# Altium schematic sheet Sch_Form.SchDoc: Cloud & LoRa Based IoT Hub v1.0
size A3; Engineer: Selcuk Cinar; Organization: SELCUK ELECTRONICS; DocumentNumber: 0; SheetNumber: 1
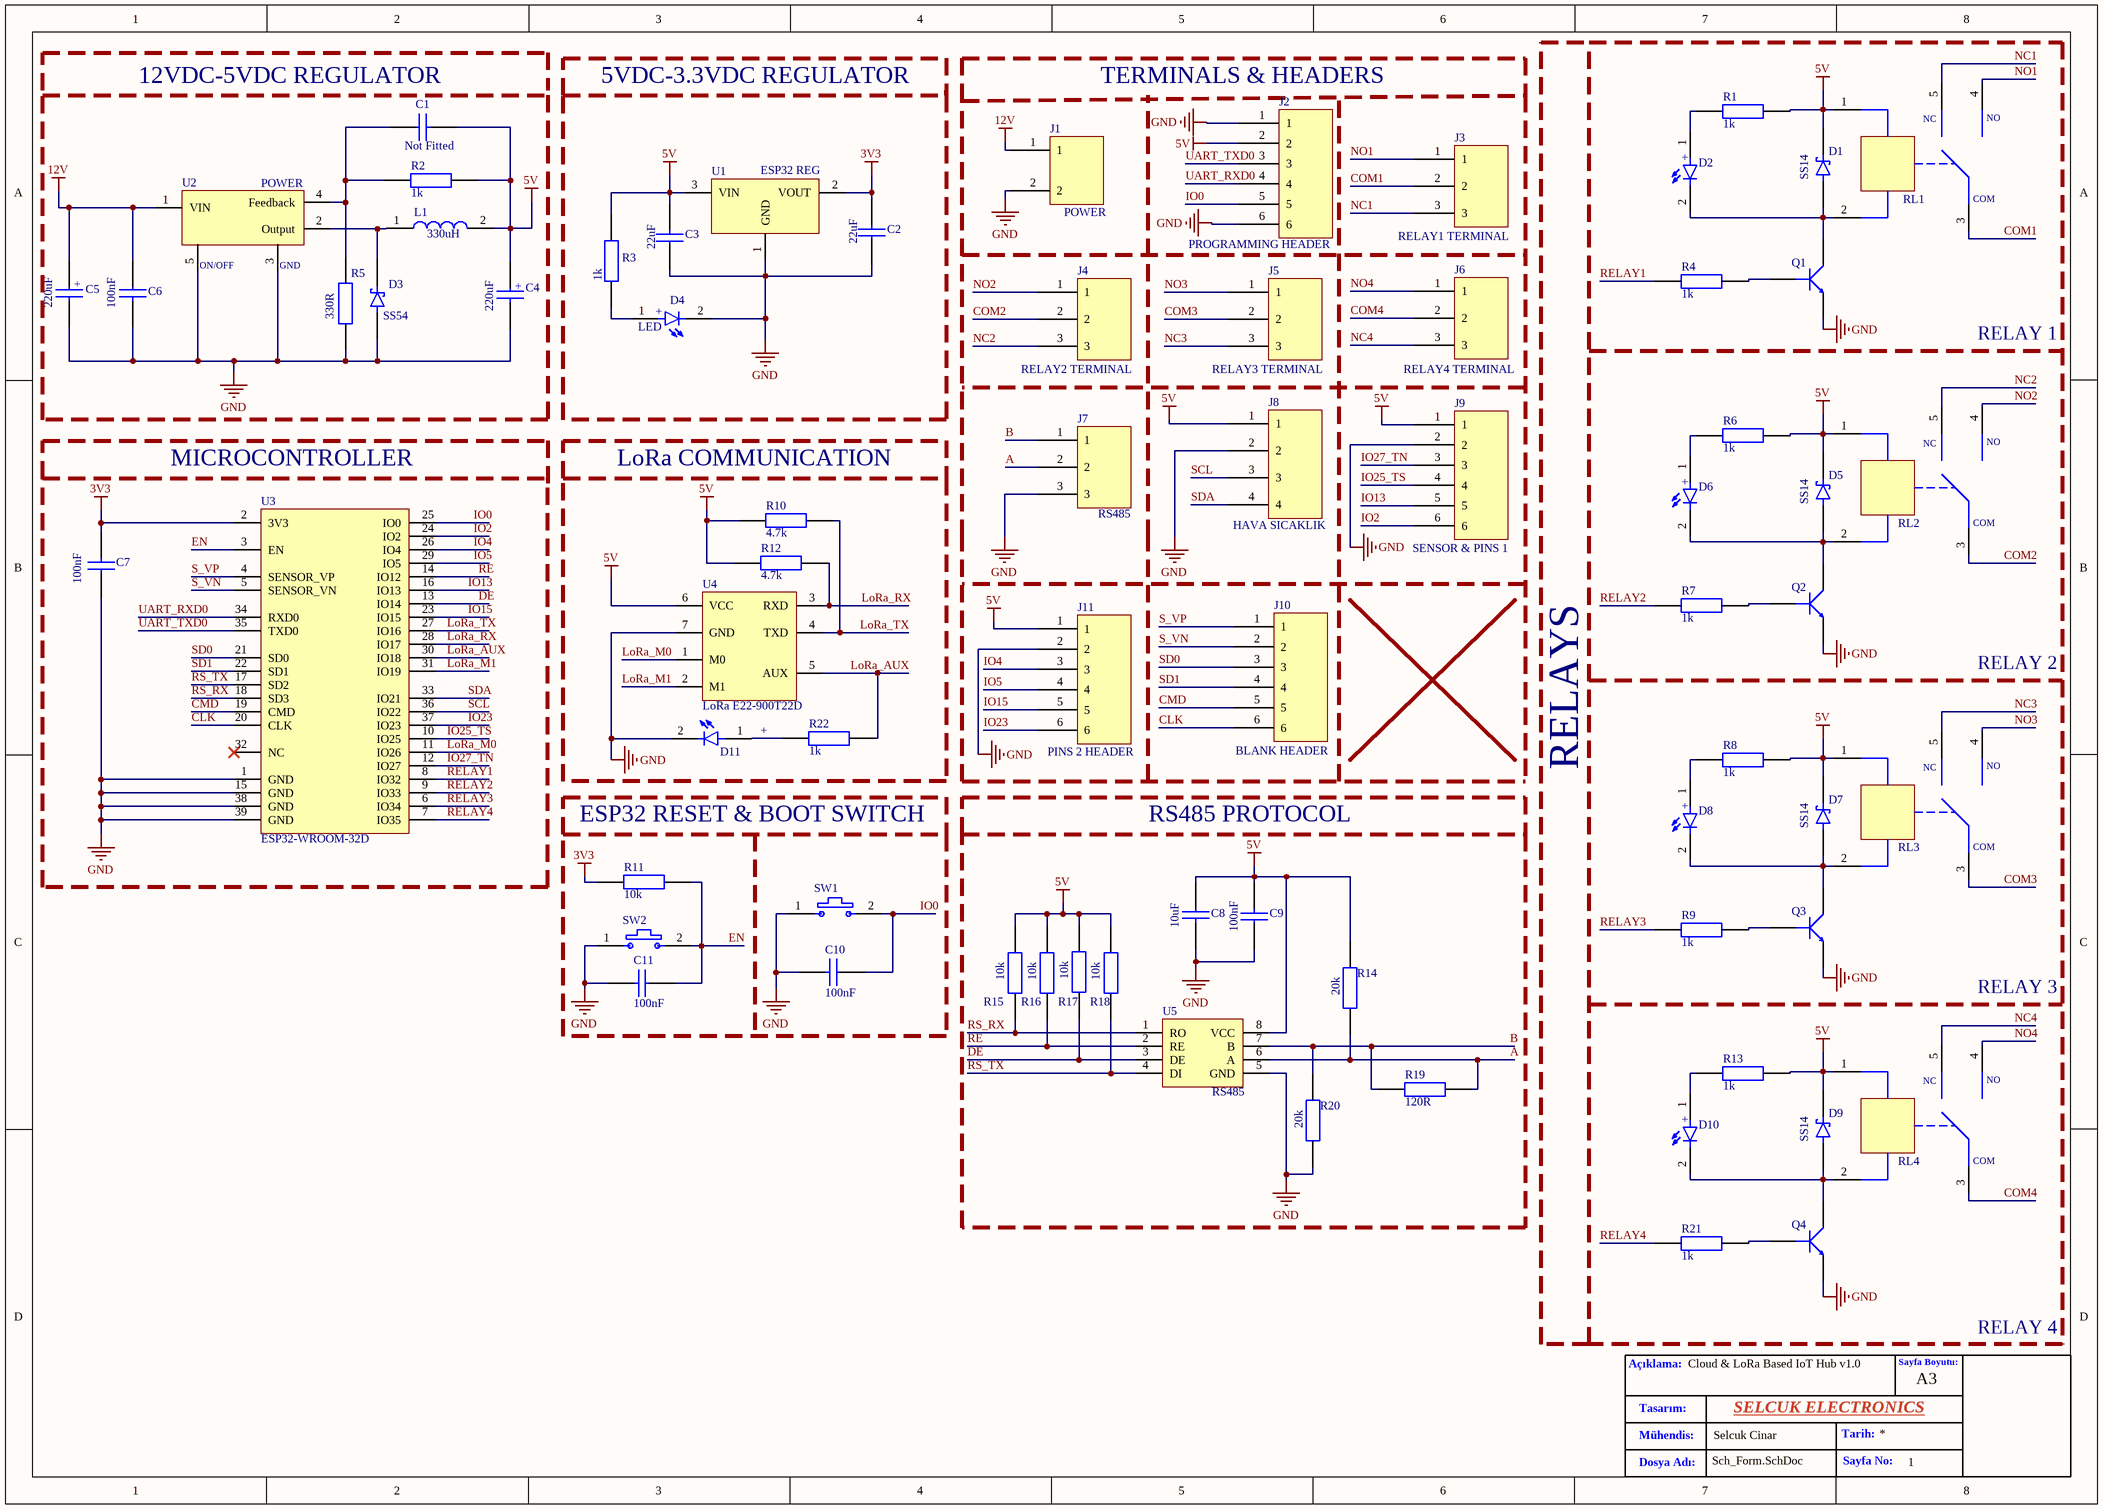
[diagram p0: Sch_Form.SchDoc]

## Parts
C1  Not Fitted  [0805 FITTED CAP]
C2  22uF  [0805 22uF CAP]
C3  22uF  [0805 22uF CAP]
C4  220uF  [220/35V/VT ECAP-0810]
C5  220uF  [100/50V/VT ECAP-0810]
C6  100nF  [0805 100nF CAP]
C7  100nF  [0805 100nF CAP]
C8  10uF  [1206 10uF CAP]
C9  100nF  [0805 100nF CAP]
C10  100nF  [0805 100nF CAP]
C11  100nF  [0805 100nF CAP]
D1  SS14  [SS14-DO-214AC]
D2  LED  [1206 LED]  (value not drawn)
D3  SS54  [SS34]
D4  LED  [1206 LED]
D5  SS14  [SS14-DO-214AC]
D6  LED  [1206 LED]  (value not drawn)
D7  SS14  [SS14-DO-214AC]
D8  LED  [1206 LED]  (value not drawn)
D9  SS14  [SS14-DO-214AC]
D10  LED  [1206 LED]  (value not drawn)
D11  LED  [1206 LED]  (value not drawn)
J1  POWER  [Terminal 2]
J2  PROGRAMMING HEADER  [1x6 HEADER]
J3  RELAY1 TERMINAL  [TERMINAL 3]
J4  RELAY2 TERMINAL  [TERMINAL 3]
J5  RELAY3 TERMINAL  [TERMINAL 3]
J6  RELAY4 TERMINAL  [TERMINAL 3]
J7  RS485  [TERMINAL 3]
J8  HAVA SICAKLIK  [TERMINAL 4]
J9  SENSOR & PINS 1  [TERMINAL 6]
J10  BLANK HEADER  [1x6 HEADER]
J11  PINS 2 HEADER  [1x6 HEADER]
L1  POWER IND  [330uH/470 - INDUCTOR]  (value not drawn)
Q1  RELAY TRANSISTOR  [BC847 NPN]  (value not drawn)
Q2  RELAY TRANSISTOR  [BC847 NPN]  (value not drawn)
Q3  RELAY TRANSISTOR  [BC847 NPN]  (value not drawn)
Q4  RELAY TRANSISTOR  [BC847 NPN]  (value not drawn)
R1  1k  [0805 1K RES]
R2  1k  [0805 1K RES]
R3  1k  [0805 1K RES]
R4  1k  [0805 1K RES]
R5  330R  [0805 330R RES]
R6  1k  [0805 1K RES]
R7  1k  [0805 1K RES]
R8  1k  [0805 1K RES]
R9  1k  [0805 1K RES]
R10  4.7k  [0805 4.7k RES]
R11  10k  [0805 10k RES]
R12  4.7k  [0805 4.7k RES]
R13  1k  [0805 1K RES]
R14  20k  [0805 20k RES]
R15  10k  [0805 10k RES]
R16  10k  [0805 10k RES]
R17  10k  [0805 10k RES]
R18  10k  [0805 10k RES]
R19  120R  [0805 120R RES]
R20  20k  [0805 20k RES]
R21  1k  [0805 1K RES]
R22  1k  [0805 1K RES]
RL1  3V3 RELAY  [SONGLE SRD-03VDC-SL-C]  (value not drawn)
RL2  3V3 RELAY  [SONGLE SRD-03VDC-SL-C]  (value not drawn)
RL3  3V3 RELAY  [SONGLE SRD-03VDC-SL-C]  (value not drawn)
RL4  3V3 RELAY  [SONGLE SRD-03VDC-SL-C]  (value not drawn)
SW1  SWITCH  [BUTTON]  (value not drawn)
SW2  SWITCH  [BUTTON]  (value not drawn)
U1  ESP32 REG  [AMS1117]
U2  POWER  [LM2596S]
U3  ESP32-WROOM-32D  [ESP32-WROOM-32D]
U4  LoRa E22-900T22D  [E22-900T22D]
U5  RS485  [MAX485]

## Blocks framed on the sheet
12VDC-5VDC REGULATOR: C1 C4-C6 D3 L1 R2 R5 U2

## Nets
3V3: C2.1 C7.1 R11.1 U1.2(VOUT) U3.2(3V3)
5V: C1.1 C3.1 C4.1(+) C8.2 C9.1 D1.2 D5.2 D7.2 D9.2 J2.2 J8.1 J9.1 J11.1 L1.2 R1.2 R2.2 R3.2 R6.2 R8.2 R10.2 R12.2 R13.2 R14.2 R15.2 R16.2 R17.2 R18.2 RL1.1(+) RL2.1(+) RL3.1(+) RL4.1(+) U1.3(VIN) U4.6(VCC) U5.8(VCC)
12V: C5.1(+) C6.2 J1.1 U2.1(VIN)
GND: C2.2 C3.2 C4.2(-) C5.2(-) C6.1 C7.2 C8.1 C9.2 C10.1 C11.1 D3.1(A) D4.2 D11.2 J1.2 J2.1 J2.6 J7.3 J8.2 J9.2 J11.2 Q1.2(E) Q2.2(E) Q3.2(E) Q4.2(E) R5.1 R20.1 SW1.1 SW2.1 U1.1(GND) U2.3(GND) U2.5(ON/OFF) U3.1(GND) U3.15(GND) U3.38(GND) U3.39(GND) U4.7(GND) U5.5(GND)
A: J7.2 R14.1 R19.2 U5.6(A)
B: J7.1 R19.1 R20.2 U5.7(B)
CLK: J10.6 U3.20(CLK)
CMD: J10.5 U3.19(CMD)
COM1: J3.2 RL1.3(COM)
COM2: J4.2 RL2.3(COM)
COM3: J5.2 RL3.3(COM)
COM4: J6.2 RL4.3(COM)
DE: R17.1 U3.13(IO14) U5.3(DE)
EN: C11.2 R11.2 SW2.2 U3.3(EN)
IO0: C10.2 J2.5 SW1.2 U3.25(IO0)
IO2: J9.6 U3.24(IO2)
IO4: J11.3 U3.26(IO4)
IO5: J11.4 U3.29(IO5)
IO13: J9.5 U3.16(IO13)
IO15: J11.5 U3.23(IO15)
IO23: J11.6 U3.37(IO23)
IO25_TS: J9.4 U3.10(IO25)
IO27_TN: J9.3 U3.12(IO27)
LoRa_AUX: R22.2 U3.30(IO18) U4.5(AUX)
LoRa_M0: U3.11(IO26) U4.1(M0)
LoRa_M1: U3.31(IO19) U4.2(M1)
LoRa_RX: R12.1 U3.28(IO17) U4.3(RXD)
LoRa_TX: R10.1 U3.27(IO16) U4.4(TXD)
NC1: J3.3 RL1.5(NC)
NC2: J4.3 RL2.5(NC)
NC3: J5.3 RL3.5(NC)
NC4: J6.3 RL4.5(NC)
NO1: J3.1 RL1.4(NO)
NO2: J4.1 RL2.4(NO)
NO3: J5.1 RL3.4(NO)
NO4: J6.1 RL4.4(NO)
RE: R16.1 U3.14(IO12) U5.2(RE)
RELAY1: R4.1 U3.8(IO32)
RELAY2: R7.1 U3.9(IO33)
RELAY3: R9.1 U3.6(IO34)
RELAY4: R21.1 U3.7(IO35)
RS_RX: R15.1 U3.18(SD3) U5.1(RO)
RS_TX: R18.1 U3.17(SD2) U5.4(DI)
S_VN: J10.2 U3.5(SENSOR_VN)
S_VP: J10.1 U3.4(SENSOR_VP)
SCL: J8.3 U3.36(IO22)
SD0: J10.3 U3.21(SD0)
SD1: J10.4 U3.22(SD1)
SDA: J8.4 U3.33(IO21)
UART_RXD0: J2.4 U3.34(RXD0)
UART_TXD0: J2.3 U3.35(TXD0)
NetC1_2: C1.2 R2.1 R5.2 U2.4(Feedback)
NetD1_1: D1.1 D2.2 Q1.3(C) RL1.2(-)
NetD2_1: D2.1 R1.1
NetD3_2: D3.2(K) L1.1 U2.2(Output)
NetD4_1: D4.1 R3.1
NetD5_1: D5.1 D6.2 Q2.3(C) RL2.2(-)
NetD6_1: D6.1 R6.1
NetD7_1: D7.1 D8.2 Q3.3(C) RL3.2(-)
NetD8_1: D8.1 R8.1
NetD9_1: D9.1 D10.2 Q4.3(C) RL4.2(-)
NetD10_1: D10.1 R13.1
NetD11_1: D11.1 R22.1
NetQ1_1: Q1.1(B) R4.2
NetQ2_1: Q2.1(B) R7.2
NetQ3_1: Q3.1(B) R9.2
NetQ4_1: Q4.1(B) R21.2

Not connected (* = marked no-connect by the designer): U3 32(NC)*

## Notes on the sheet
- 5VDC-3.3VDC REGULATOR
- (near J2) TERMINALS & HEADERS
- (near D2) +
- (near D4) +
- RELAY 1
- (near U3) MICROCONTROLLER
- (near R10) LoRa COMMUNICATION
- (near D6) +
- RELAY 2
- +
- RELAYS
- ESP32 RESET & BOOT SWITCH
- RS485 PROTOCOL
- (near D8) +
- RELAY 3
- (near D10) +
- RELAY 4
- Açıklama:
- Sayfa Boyutu:
- A3
- Mühendis:
- Tasarım:
- Tarih:
- Sayfa No:
- Dosya Adı:
- (in symbol 330uH/470 INDUCTOR) 330uH

## Library data of the parts
C1 = FITTED 0805 CAP: Fılter Cap(No Value) for Power Module POWER
C2 C3 = 22uF 0805 CAP: 22uF 0805 CAP AMS1117
C4 = 220/35V/VT ECAP-0810: Power Module 0810 Electrolyte Cap POWER
C5 = 100/50V/VT ECAP-0810: Power Module 0810 Electrolyte Cap POWER
C6 C7 C9-C11 = 100nF 0805 CAP: 100nF CAP POWER
C8 = 10uF 1206 CAP: 10uF Cap - RS485
D1 D5 D7 D9 = SS14-DO-214AC: 1A 40V Schottky Diode
D2 D4 D6 D8 D10 D11 = 1206 LED
D3 = SS34 Schottky Diode: SS34 SCHOTTKY DIODE MODULE POWER
J1 = TERMINAL 2: 2-PIN KLEMENS
J2 J10 J11 = 1x6 Header
J3-J7 = TERMINAL 3: 3-PIN KLEMENS
J8 = TERMINAL 4: 4-PIN KLEMENS
J9 = TERMINAL 6: 6-PIN 90 DEGREE
L1 = 330uH/470 INDUCTOR: Power Module 0810 Inductor 12.3mmx12.3mm POWER
Q1-Q4 = BC487 TRANSISTOR: BC847 Transistör Npn Smd Sot-23100mA, 45V NPN
R1-R4 R6-R9 R13 R21 R22 = 1K 0805 RES: 1K 0805 SMD RES POWER
R5 = 330R 0805 RES: 330R 0805 SMD RES POWER
R10 R12 = 4.7k 0805 RES: 4.7k RES for LoRa Pull-Up
R11 = 10k 0805 RES: 10k Resistor-RS485
R14 R20 = 20k 0805 RES: 20k Resistor - RS485
R15-R18 = 10k 0805 RES: 10k Resistor - RS485
R19 = 120R 0805 RES: 120R Resistor - RS485
RL1-RL4 = SRD-03VDC-SL-C: 3.3V Relay
SW1 SW2 = BUTTON: Switch For ESP32
U1 = AMS1117-3.3V REG: 5V to 3V3 Reg. for ESP32
U2 = LM2596S: 5V REGULATOR
U3 = ESP32-WROOM-32D: SMD MODULE, ESP32-D0WDQ6, 32MBIT (FootPrint ölçüleri doğru 3D 'ye takılma)
U4 = E22-900T22D: Ebyte LoRa 22dBm 5-7km Communication Module
U5 = MAX485: RS485 Chip